# Altium schematic sheet POWER.SchDoc
size A4; SheetNumber: 7; SheetTotal: 7; SPICEModelCacheBESSMCSR: <root> / <DocumentId>BESSMCSR</DocumentId> / </root>
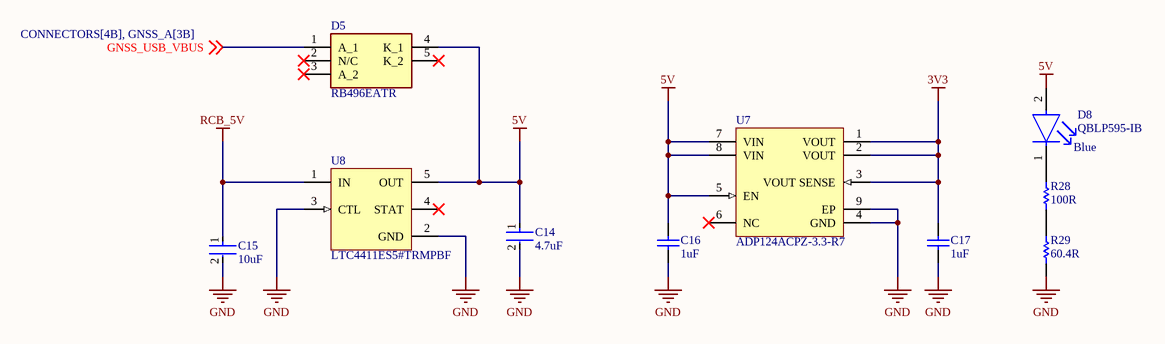
[diagram p0: POWER.SchDoc]

## Parts
C14  4.7uF  [FP-C1005-050-0_15-MFG]
C15  10uF  [FP-0603-L_1_6_0_2-W_0_8_0-MFG]
C16  1uF  [CAPC1005X55X25ML05T10]
C17  1uF  [CAPC1005X55X25ML05T10]
D5  RB496EATR  [SOT95P280X100-5N]
D8  QBLP595-IB  Color: Blue  [FP-QBLP595-IB-MFG]
R28  100R  [RESC1005X40X25LL05T05]
R29  60.4R  [RESC1005X40X25ML05T05]
U7  ADP124ACPZ-3.3-R7  [ADI-CP-8-8_V]
U8  LTC4411ES5#TRMPBF  [LT-S5-5-TSOT-23_N]

## Nets
3V3: C17.2 U7.1(VOUT) U7.2(VOUT) U7.3(VOUT_SENSE)
5V: C14.1 C16.2 D5.4(K_1) D8.2(A) U7.5(EN) U7.7(VIN) U7.8(VIN) U8.5(OUT)
GND: C14.2 C15.2 C16.1 C17.1 R29.2 U7.4(GND) U7.9(EP) U8.2(GND) U8.3(CTL)
RCB_5V: C15.1 U8.1(IN)
GNSS_USB_VBUS: D5.1(A_1) ; off-sheet GNSS_USB_VBUS
NetD8_1: D8.1(C) R28.2
NetR28_1: R28.1 R29.1

Not connected (* = marked no-connect by the designer): D5 2(N/C)* 3(A_2)* 5(K_2)*; U7 6(NC)*; U8 4(STAT)*

## Library data of the parts
C14 = CMP-2000-05997-2: CAP CER 4.7UF 10V X5R 0402; Dielectric Material: Ceramic; Tolerance: 10%; Series: C; Package Quantity: 10000; Max Operating Temperature: 85°C; Case Code (Imperial): 0402; Lead Free: Lead Free; Voltage Rating (DC): 10V; Packaging: Cut Tape; Voltage Rating: 10V; Min Operating Temperature: -55°C; Dielectric: X5R; Thickness: 0.022inch; Width: 0.02inch; Case/Package: 0402; Case Code (Metric): 1005; Capacitance: 4.7uF; Length: 0.039inch; RoHS Compliant: Yes; REACH SVHC: No SVHC; Mount: Surface Mount
C15 = CMP-2000-06226-4: Multilayer Ceramic Capacitor 10uF 16V X5R 20% SMD 0603 T/R; Packaging: Tape and Reel; Construction: Flat; Height: 0.8mm; Max Operating Temperature: 85°C; Dielectric: X5R; Case Code (Metric): 1608; Voltage Rating (DC): 16V; Width: 0.031inch; Voltage Rating: 16V; Length: 0.063inch; RoHS Compliant: Yes; Halogen Free: Halogen Free; Case Code (Imperial): 0603; Capacitance: 10uF; Mount: Surface Mount; Thickness: 0.031inch; Tolerance: 20%; Min Operating Temperature: -55°C; Series: M; Termination: SMD/SMT; Case/Package: 0603; Package Quantity: 1
C16 C17 = CMP-2008-04506-1: Part Number: GRM155C80J105KE15D; Manufacturer: Murata
D5 = RB496EATR: Schottky Diode; Manufacturer_Name: ROHM Semiconductor; Datasheet Link: https://fscdn.rohm.com/en/products/databook/datasheet/discrete/diode/schottky_barrier/rb496eatr-e.pdf; Height: 1mm; Manufacturer_Part_Number: RB496EATR; Mouser Part Number: 755-RB496EATR; Mouser Price/Stock: https://www.mouser.co.uk/ProductDetail/ROHM-Semiconductor/RB496EATR/?qs=4kLU8WoGk0tzYHEk1W59vw%3D%3D
D8 = CMP-113271-000002-1: LED BLUE CLEAR 0402 SMD; Lens Size: 0.5mm; Dominant Wavelength: 465nm; Forward Voltage: 3.1V; Lens Color: Colorless; Luminous Intensity: 85mcd; Test Current: 20mA; Viewing Angle: 140°; Lens Style: Flat; Width: 0.5mm; Case Code (Metric): 1005; Lens Transparency: Clear; Packaging: Tape and Reel; Case Code (Imperial): 0402; Mount: Surface Mount; Length: 1mm; Case/Package: 0402; Height: 0.6mm
R28 = CMP-2002-00605-3: Chip Resistor, 100 Ohm, +/- 1%, 100 mW, -55 to 155 degC, 0402 (1005 Metric), RoHS, Tape and Reel; Manufacturer: Basic Passives; PartNumber: ERJ-2RKF1000X; Power Rating: 100 mW; Resistance: 100 Ohm; Voltage Rating: 50 V; Case\/Package: 0402; Width: 0.5 mm; Pins: 2; ComponentLink2Description: Datasheet; PackageReference: 0402; Height: 0.35 mm; Tolerance: 1%; DatasheetVersion: 04/2015; Case Code (Imperial): 0402; Min Operating Temperature: -55 degC; Radiation Hardening: No; Length: 1 mm; Package Quantity: 10000; PackageDescription: 2-Pin Surface Mount Device, Body 1 x 0.5 mm; Mounting Technology: Surface Mount; Case Code (Metric): 1005; Packaging: Tape and Reel; ComponentLink1URL: http://www.panasonic.com/; RoHSCompliant: true; Max Operating Temperature: 155 degC; REACH SVHC: Yes; ComponentLink1Description: Manufacturer URL; ComponentLink2URL: http://industrial.panasonic.com/cdbs/www-data/pdf/RDA0000/AOA0000C86.pdf; Mount: Surface Mount
R29 = CMP-2002-01009-1: Part Number: ERJ-2RKF6040X; Manufacturer: Panasonic
U7 = CMP-0786-00127-1: 500 mA, Low Quiescent Current, CMOS Linear Regulator, 2.3 to 5.5 V Vin, 3.3 V Vout, Industrial, 8-pin SON (CP-8-8), Reel; Manufacturer: Analog Devices; Iout max: 500mA; Preset Vout Values (V): 3.3; Supply Current IGND @ Small Load: 45uA; Vin (min) (V): 2.3; Vin (max) (V): 5.5; Mounting Technology: Surface Mount; PackageVersion: 101028-A, 10/2008; ComponentLink3URL: http:/www.analog.com/static/imported-files/packages/PKG_PDF/LFCSP(CP)/CP_8_8.pdf; DatasheetVersion: Rev. C; ComponentLink1Description: Manufacturer URL; PartNumber: ADP124ACPZ-3.3-R7; ComponentLink2Description: Datasheet; ComponentLink4URL: Product URL:http://www.analog.com/en/ADP124/productSearch.html; ComponentLink1URL: http://www.analog.com/en/index.html; PackageReference: CP-8-8; ComponentLink2URL: http://www.analog.com/static/imported-files/data_sheets/ADP124_125.pdf; ComponentLink4Description: URL Link1; PackageDescription: 8-Pin Lead Frame Chip Scale Package, Body 2 x 2 mm, Pitch 0.5 mm; Packing: Reel; ComponentLink3Description: Package Specification
U8 = CMP-0479-00414-1: Integrated Switch: Replaces Power Supply OR, 2.6 to 5.5 V Vin, 5-pin SOT23 (S5-5), -40 to 85 degC, Pb-Free, Mini Tape and Reel; Manufacturer: Linear Technology; Ideal Diode: Single, Internal, P-Channel; ComponentLink2Description: Datasheet; ComponentLink1URL: http://www.linear.com/; RoHS: TRUE; PackageDescription: 5-Pin Plastic TSOT-23, Body 1.63 x 2.90 mm, Pitch 0.95 mm; PackageReference: S5-5; Mounting Technology: Surface Mount; PackageVersion: Jun-10; ComponentLink3URL: http://cds.linear.com/docs/en/packaging/SOT_5_05-08-1635.pdf; PartNumber: LTC4411ES5#TRMPBF; ComponentLink3Description: Package Specification; Code_JEDEC: MO-193; ComponentLink2URL: http://cds.linear.com/docs/en/datasheet/4411fa.pdf; Packing: Mini Tape and Reel; ComponentLink1Description: Manufacturer URL; DatasheetVersion: Rev. A